# EAGLE design USB_pcb_breakout (EAGLE 7.7.0)
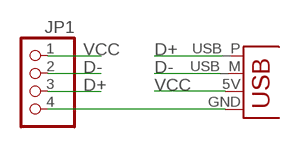
[diagram p0: schematic, sheet 1]

## Parts
JP1  PINHD-1X4  [1X04]
X1  USBPCB  [USB-A-PCB]

## Nets
D+: JP1.3 X1.USB_P(D+)
D-: JP1.2 X1.USB_M(D-)
N$1: JP1.4 X1.GND
VCC: JP1.1 X1.5V(VBUS)

## Library data of the parts
JP1 = pinhead:PINHD-1X4: PIN HEADER
X1 = SparkFun:USB: USB Connectors USB-B-PTH is fully proven SKU : PRT-00139 USB-miniB is fully proven SKU : PRT-00587 USB-A-PCB is untested. USB-A-H is throughly reviewed, but untested. Spark Fun Electronics SKU : PRT-00437 USB-B-SMT is throughly reviewed, but untested. Needs silkscreen touching up. USB-A-S has not been used/tested USB-MB-H has not been used/tested

## Board
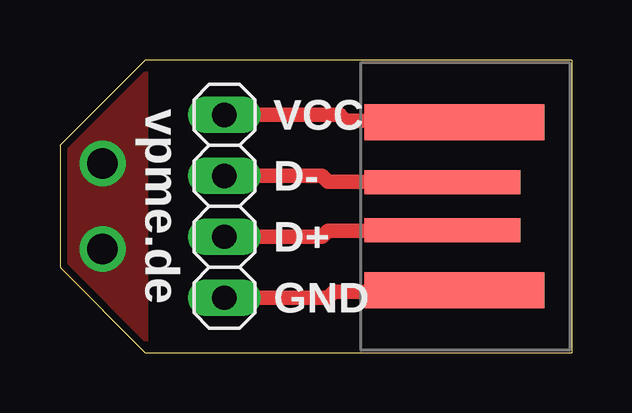
[diagram p1: board, top side]
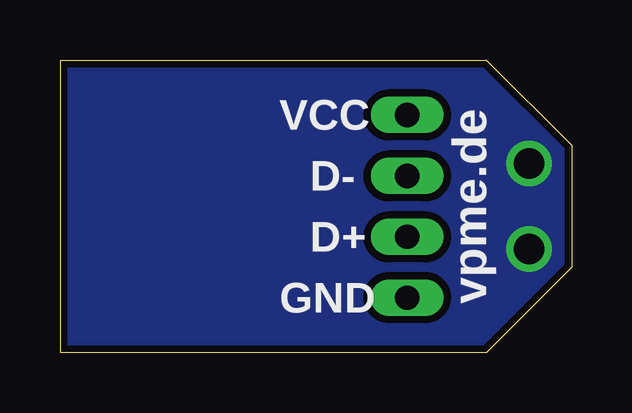
[diagram p2: board, bottom side, seen from below]

Size 21.34 x 12.19 mm. Coordinates in mm from the lower left corner, seen from the top.
Outline: 3.56,0 21.34,0 21.34,12.19 3.56,12.19 0,8.64 0,3.56 3.56,0
Copper layers (1*16): Top 0.035mm / dielectric 1.5mm / Bottom 0.035mm
Design rules "dirt_cheap_dirty_boards.v1": minimum track width 5mil, minimum drill 12mil, track to track 5mil, track to pad 5mil, pad to pad 5mil, via to via 5mil, smd to smd 0mil, copper to edge 10mil, drill to drill 10mil, minimum pad ring 10mil, minimum via ring 6mil, stop-mask expansion 2mil, vias tented up to drill 25mil, thermal gap 10mil

### Footprints (pad centres in the part's own frame; a part is rotated, then mirrored left to right if it is on the bottom)
1X04 = drill 1.016 long: 1 -3.81,0; 2 -1.27,0; 3 1.27,0; 4 3.81,0
USB-A-PCB = smd 7.5 x 1.5: 5V -0.2,-3.5; GND -0.2,3.5 | smd 6.5 x 1: USB_M 0.3,-1; USB_P 0.3,1

### Placement (x,y rotation side)
JP1  6.86,6.1 270 top
X1  16.26,6.1 180 top

### Tracks (layer width: path | path; a pad name or v marks a point on that pad's centre or on a via)
D+
  Top 0.406: X1.USB_P 15.46,5.08
  Top 0.61: 15.46,5.08 11.18,5.08 10.92,4.83 JP1.3
D-
  Top 0.406: X1.USB_M 15.94,7.11
  Top 0.61: 15.94,7.11 11.18,7.11 10.92,7.37 JP1.2
N$1
  Top 0.406: X1.GND 16.4,2.54
  Top 0.61: 16.4,2.54 11.43,2.54 11.18,2.29 JP1.4
SHIELD  (via drill 1.27)
  other vias: 1.78,7.87 1.78,4.32
  pour Bottom (isolate 0.305): 3.56,12.19 21.34,12.19 21.34,0 3.56,0 0,3.56 0,8.64
  pour Top (isolate 0.305): 3.56,0 0,3.56 0,8.64 3.56,12.19
VCC
  Top 0.406: X1.5V 16.4,9.65
  Top 0.61: 16.4,9.65 11.94,9.65 11.68,9.91 JP1.1

### Text on the board
tPlace: vpme.de | VCC | D- | D+ | GND
bPlace: VCC | D- | D+ | vpme.de | GND